# Altium schematic sheet DRV.SchDoc: DRV8320 Motor Controller
size A; DrawnBy: Huy Nguyen; Revision: v1.0; SheetNumber: 1; SheetTotal: 1
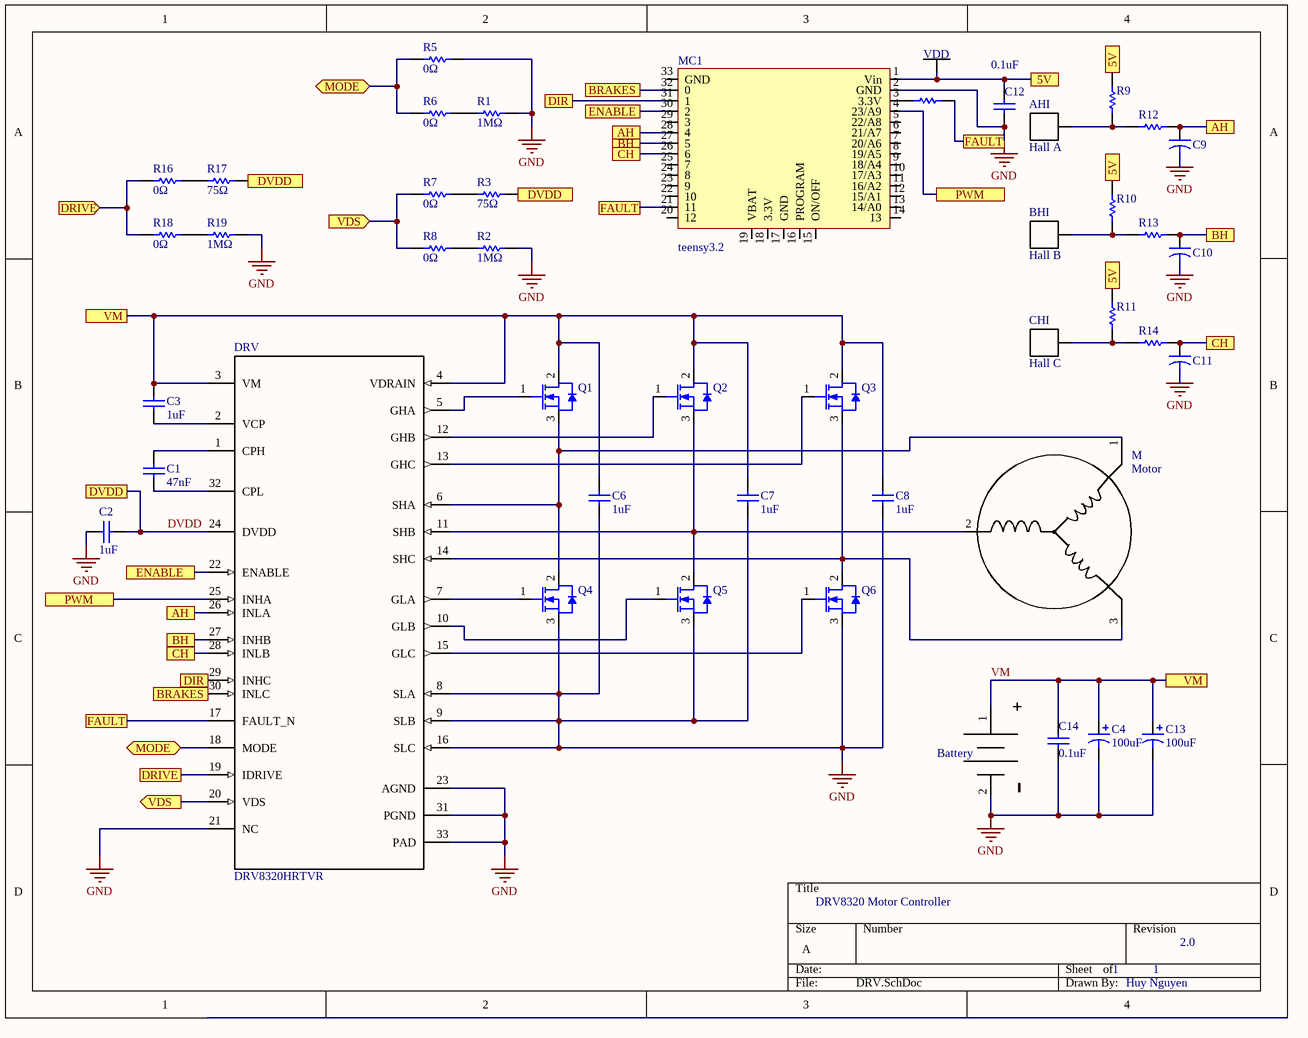
[diagram p0: DRV.SchDoc]

## Parts
5v  (no value)  [A single pin]
AHI  Hall A  [A single pin]
BHI  Hall B  [A single pin]
C1  47nF  [0805]
C2  1uF  [CAPC0805(2012)145_N]
C3  1uF  [0805]
C4  100uF  [Electrolytic TH Capacitor]
C6  1uF  [CAPC2013X135X45ML10T25]
C7  1uF  [CAPC2013X135X45ML10T25]
C8  1uF  [CAPC2013X135X45ML10T25]
C9  Cap2  [CAPR5-4X5]  (value not drawn)
C10  Cap2  [CAPR5-4X5]  (value not drawn)
C11  Cap2  [CAPR5-4X5]  (value not drawn)
C12  0.1uF  [0805]
C13  100uF  [Electrolytic TH Capacitor]
C14  0.1uF  [0805]
CHI  Hall C  [A single pin]
DRV  DRV8320HRTVR  [RTV0032E]
M  Motor  [Motor]
MC1  teensy3.2  [teensy3.2]
Q1  INFINEON  [MOSFET-2]  (value not drawn)
Q2  INFINEON  [MOSFET-2]  (value not drawn)
Q3  INFINEON  [MOSFET-2]  (value not drawn)
Q4  INFINEON  [MOSFET-2]  (value not drawn)
Q5  INFINEON  [MOSFET-2]  (value not drawn)
Q6  INFINEON  [MOSFET-2]  (value not drawn)
R1  1MΩ  [RESC2013X60X40NL20T25]
R2  1MΩ  [RESC2013X60X40NL20T25]
R3  75Ω  [RESC2013X60X40NL20T25]
R5  0Ω  [RESC2013X60X40NL20T25]
R6  0Ω  [RESC2013X60X40NL20T25]
R7  0Ω  [RESC2013X60X40NL20T25]
R8  0Ω  [RESC2013X60X40NL20T25]
R9  Res1  [AXIAL-0.3]  (value not drawn)
R10  Res1  [AXIAL-0.3]  (value not drawn)
R11  Res1  [AXIAL-0.3]  (value not drawn)
R12  Res1  [AXIAL-0.3]  (value not drawn)
R13  Res1  [AXIAL-0.3]  (value not drawn)
R14  Res1  [AXIAL-0.3]  (value not drawn)
R15  0Ω  [RESC2013X60X40NL20T25]  (value not drawn)
R16  0Ω  [RESC2013X60X40NL20T25]
R17  75Ω  [RESC2013X60X40NL20T25]
R18  0Ω  [RESC2013X60X40NL20T25]
R19  1MΩ  [RESC2013X60X40NL20T25]
VM  Battery  [12 Gauge]

## Ports
5V, AH, BH, BRAKES, CH, DIR, DRIVE, DRIVE (in), DVDD, ENABLE, FAULT, MODE (bidir), PWM, VDS (in), VDS (out), VM

## Nets
GND: C2.2 C4.2 C6.1 C7.1 C8.1 C9.2 C10.2 C11.2 C12.1 C13.2 C14.1 DRV.8(SLA) DRV.9(SLB) DRV.16(SLC) DRV.21(NC) DRV.23(AGND) DRV.31(PGND) DRV.33(PAD) MC1.2(GND) Q4.3(S) Q5.3(S) Q6.3(S) R1.2 R2.2 R5.2 R19.2 VM.2
5V: 5v.0 C12.2 MC1.1(Vin) R9.2 R10.2 R11.2 ; port 5V
AH: C9.1 DRV.26(INLA) MC1.28(4) R12.2 ; port AH
BH: C10.1 DRV.27(INHB) MC1.27(5) R13.2 ; port BH
BRAKES: DRV.30(INLC) MC1.32(0) ; port BRAKES
CH: C11.1 DRV.28(INLB) MC1.26(6) R14.2 ; port CH
DIR: DRV.29(INHC) MC1.31(1) ; port DIR
DRIVE: DRV.19(IDRIVE) R16.1 R18.1 ; port DRIVE
DVDD: C2.1 DRV.24(DVDD) R3.2 R17.2 ; port DVDD
ENABLE: DRV.22(ENABLE) MC1.30(2) ; port ENABLE
FAULT: DRV.17(FAULT_N) MC1.21(11) R15.2 ; port FAULT
MODE: DRV.18(MODE) R5.1 R6.1 ; port MODE
PWM: DRV.25(INHA) MC1.4(23/A9) ; port PWM
VDS: DRV.20(VDS) R7.1 R8.1 ; port VDS
VM: C3.2 C4.1 C6.2 C7.2 C8.2 C13.1 C14.2 DRV.3(VM) DRV.4(VDRAIN) Q1.2(D) Q2.2(D) Q3.2(D) VM.1 ; port VM
NetAHI_0: AHI.0 R9.1 R12.1
NetBHI_0: BHI.0 R10.1 R13.1
NetC1_1: C1.1 DRV.32(CPL)
NetC1_2: C1.2 DRV.1(CPH)
NetC3_1: C3.1 DRV.2(VCP)
NetCHI_0: CHI.0 R11.1 R14.1
NetDRV_5: DRV.5(GHA) Q1.1(G)
NetDRV_6: DRV.6(SHA) M.1(A) Q1.3(S) Q4.2(D)
NetDRV_7: DRV.7(GLA) Q4.1(G)
NetDRV_10: DRV.10(GLB) Q5.1(G)
NetDRV_11: DRV.11(SHB) M.2(B) Q2.3(S) Q5.2(D)
NetDRV_12: DRV.12(GHB) Q2.1(G)
NetDRV_13: DRV.13(GHC) Q3.1(G)
NetDRV_14: DRV.14(SHC) M.3(C) Q3.3(S) Q6.2(D)
NetDRV_15: DRV.15(GLC) Q6.1(G)
NetMC1_3: MC1.3(3.3V) R15.1
NetR1_1: R1.1 R6.2
NetR2_1: R2.1 R8.2
NetR3_1: R3.1 R7.2
NetR16_2: R16.2 R17.1
NetR18_2: R18.2 R19.1

Not connected (* = marked no-connect by the designer): MC1 5(22/A8) 6(21/A7) 7(20/A6) 8(19/A5) 9(18/A4) 10(17/A3) 11(16/A2) 12(15/A1) 13(14/A0) 14(13) 15(ON/OFF) 16(PROGRAM) 17(GND) 18(3.3V) 19(VBAT) 20(12) 22(10) 23(9) 24(8) 25(7) 29(3) 33(GND)

## Notes on the sheet
- 2.0
- (in symbol 10V) VDD
- (in symbol Battery) +; -

## Library data of the parts
5v = 10V
AHI BHI CHI = Hall Sensor
C1 = C0805C473K5RACTU: 0.047µF 50V 10% X7R 0805; Manufacturer 1: KEMET; Dielectric Material: Ceramic; Supplier 1: Digi-Key; Manufacturer Part Number 1: C0805C473K5RACTU; Stock 1: 1440571; Pricing 1: 1=0.20000, 10=0.13900, 100=0.06550, 500=0.04590, 1000=0.03800 (USD); RoHS: Yes; Mount: Surface Mount; Case/Package: 0805; Min Operating Temperature: -55°C; Max Operating Temperature: 125°C; Capacitance: 47nF; Tolerance: 10%; Packaging: Tape and Reel; Dielectric: X7R; Voltage Rating (DC): 50V; Length: 2mm; Height: 0.78mm; Depth: 1.25mm; Radiation Hardening: No; ComponentLink1URL: https://datasheet.ciiva.com/22749/1918693-22749589.pdf?src-supplier=Element14; ComponentLink1Description: https://datasheet.ciiva.com/22749/1918693-22749589.pdf?src-supplier=Element14; Supplier Part Number 1: 399-1166-1-ND
C2 = CMP-1036-04731-1: CAP 1uF 6.3V ±10% 0805 (2012 Metric) Thickness 1.45mm SMD; Case-Metric: 2012; Case-EIA: 0805; Tolerance: Â±10%; Max Thickness: 1.45 mm; Technology: SMT; Value: 1uF; Rated Voltage: 6.3 V
C3 C12 C14 = C0805C473K5RACTU: 1µF 50V 10% X7R 0805; Manufacturer 1: KEMET; Dielectric Material: Ceramic; Capacitance: 47nF; Supplier 1: Digi-Key; Manufacturer Part Number 1: C0805C473K5RACTU; Stock 1: 1440571; Pricing 1: 1=0.20000, 10=0.13900, 100=0.06550, 500=0.04590, 1000=0.03800 (USD); RoHS: Yes; Mount: Surface Mount; Case/Package: 0805; Min Operating Temperature: -55°C; Max Operating Temperature: 125°C; Tolerance: 10%; Packaging: Tape and Reel; Dielectric: X7R; Voltage Rating (DC): 50V; Length: 2mm; Height: 0.78mm; Depth: 1.25mm; Radiation Hardening: No; ComponentLink1URL: https://datasheet.ciiva.com/22749/1918693-22749589.pdf?src-supplier=Element14; ComponentLink1Description: https://datasheet.ciiva.com/22749/1918693-22749589.pdf?src-supplier=Element14; Supplier Part Number 1: 399-1166-1-ND
C4 C13 = Cap Pol1: Polarized Capacitor (Radial); Value: 100pF; Published: 8-Jun-2000; LatestRevisionDate: 17-Jul-2002; LatestRevisionNote: Re-released for DXP Platform.; PackageReference: RB7.6-15; Publisher: Altium Limited; PackageDescription: Polarized Capacitor (Radial); 2 Leads
C6-C8 = CMP-2100-03644-1: Chip Capacitor, 1 uF, +/- 10%, 50 V, -55 to 125 degC, 0805 (2012 Metric), RoHS, Tape and Reel; Manufacturer: Murata; Voltage: 50V; Capacitance: 100nF; Insulation Resistance: 10GR; Dielectric Material: Ceramic; Dielectric: X7R; Package Description: 2-Pin Surface Mount Device, Body 2 x 1.25 mm; Manufacturer URL: http://www.murata.com/; Case Code (Imperial): 0805; Datasheet URL: http://psearch.en.murata.com/capacitor/product/GRM21BR71H104KA01%23.pdf; Termination: SMD/SMT; Lead Free: LeadFree; Package Quantity: 1; Mount: SurfaceMount; REACH SVHC: Unknown; Thickness: 0.053inch; Height: 1.25mm; Case/Package: 0805; Voltage Rating: 50V; Width: 0.049inch; Case Code (Metric): 2012; Material: Ceramic; Min Operating Temperature: -55degC; RoHSCompliant: true; Datasheet Version: 42675.0; Voltage Rating (DC): 50V; Tolerance: 10%; Package Reference: 0805; Depth: 1.25mm; Length: 2mm; Max Operating Temperature: 125degC; Packaging: TapeandReel; Number of Pins: 2; Radiation Hardening: No
DRV = DRV8320HRTVR: Manufacturer 1: Texas Instruments; Supplier 1: Digi-Key; Manufacturer Part Number 1: DRV8320HRTVR; Stock 1: 7874; Pricing 1: 1=3.07000, 10=2.75800, 100=2.25960, 500=1.92352, 1000=1.62225 (USD); RoHS: No; Min Operating Temperature: -40°C; Max Operating Temperature: 125°C; Supplier Part Number 1: 296-48909-1-ND
R1-R3 R5-R8 R15-R19 = CMP-2001-00629-1: Part Number: ERA6AEB332V; Manufacturer: Panasonic
R9-R14 = Res1: Resistor; Published: 8-Jun-2000; LatestRevisionDate: 17-Jul-2002; LatestRevisionNote: Re-released for DXP Platform.; PackageReference: AXIAL-0.3; Publisher: Altium Limited; PackageDescription: Axial Device, Thru-Hole; 2 Leads; 0.3 in Pin Spacing
C9-C11 = Cap2: Published: 23-Sep-2002; PackageReference: CAPR5-4X5; Publisher: Altium Limited; PackageDescription: Capacitor; 2 Leads